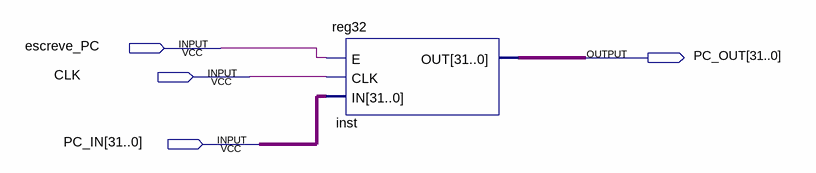
[diagram p0: schematic sheet]
// Quartus schematic program_counter.bdf as structural Verilog: 1 symbols, 4 pins
module program_counter (
  input  escreve_PC,
  input  CLK,
  input  [31:0] PC_IN,
  output [31:0] PC_OUT
);

  reg32 inst (.E(escreve_PC), .CLK(CLK), .IN(PC_IN), .OUT(PC_OUT));
endmodule
